# EAGLE design USBIRtoy.v1-pub (EAGLE 5.07)
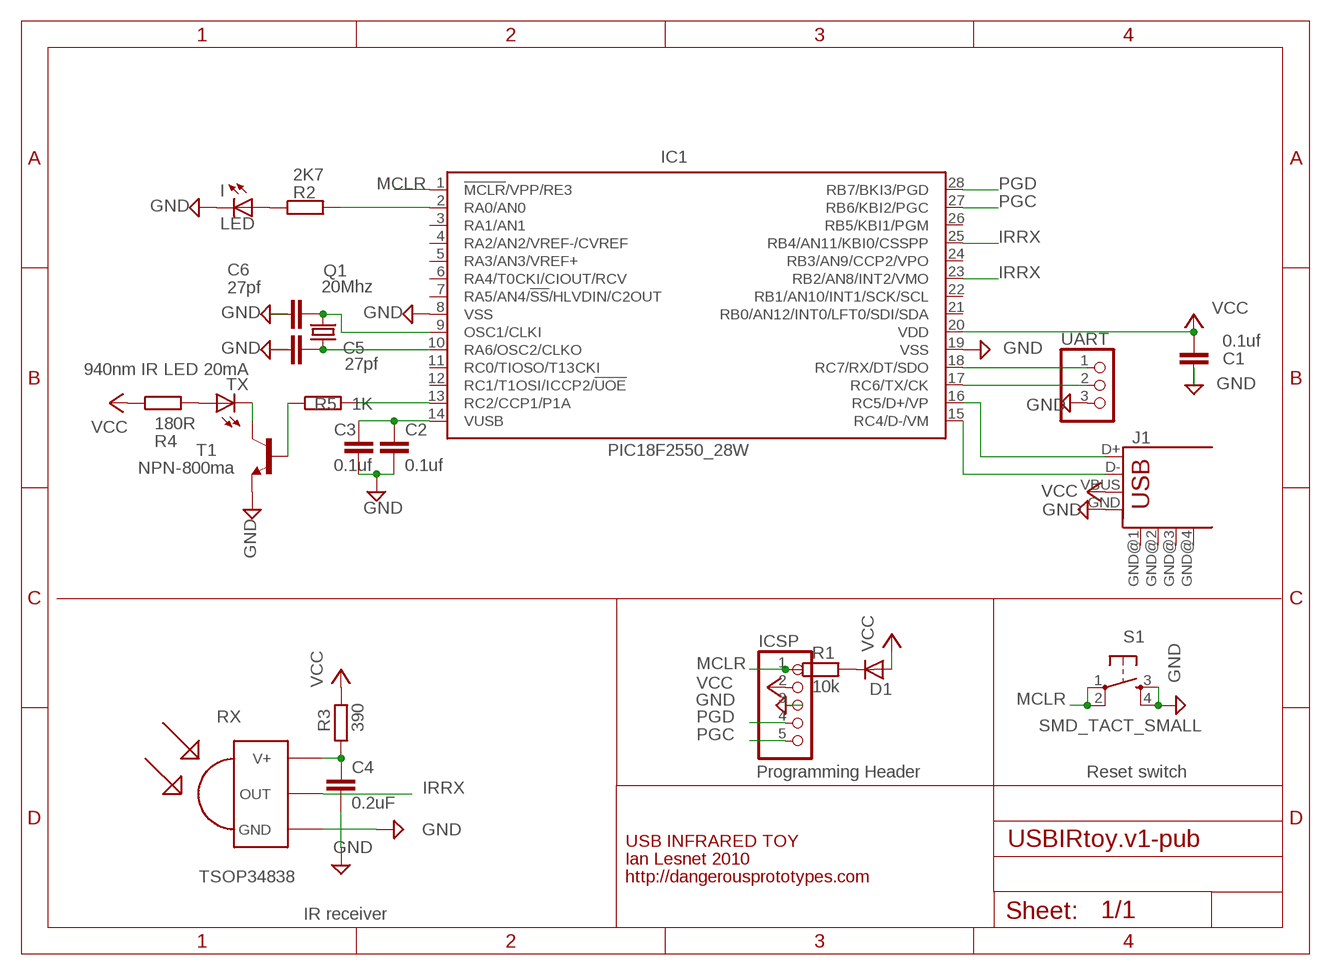
[diagram p0: schematic, sheet 1]

## Parts
C1  0.1uf  C-EUC0805  [C0805]
C2  0.1uf  C-EUC0805  [C0805]
C3  0.1uf  C-EUC0805  [C0805]
C4  0.2uF  C-EUC0805  [C0805]
C5  27pf  C-EUC0805  [C0805]
C6  27pf  C-EUC0805  [C0805]
D1  DIODE_SOD-323  [SOD2514X100N]
I  LED  LEDCHIP-LED0805  [CHIP-LED0805]
IC1  PIC18F2550_28W  [SO28W]
ICSP  PINHD-1X5  [1X05]
J1  USB-SHIELD  [USB-M-S1]
Q1  20Mhz  CRYSTALHC49UP  [HC49UP]
R1  10k  R-EU_R0805  [R0805]
R2  2K7  R-EU_M0805  [M0805]
R3  390  R-EU_M0805  [M0805]
R4  180R  R-EU_M0805  [M0805]
R5  1K  R-EU_M0805  [M0805]
S1  SMD_TACT_SMALL  [TACT_SWITCH_SMALL]
T1  NPN-800ma  BCX70SMD  [SOT23]
TSOP34838  TSOP34838  TSOP4838  [TSOP18XX]
TX  940nm IR LED 20mA  LED5MM  [LED5MM]
UART  PINHD-1X3  [1X03]

## Nets
GND: C1.2 C2.2 C3.2 C4.2 C5.2 C6.2 I.C IC1.8(VSS) IC1.19(VSS) ICSP.3 J1.GND S1.3 S1.4 T1.2(E) TSOP34838.GND UART.3
IRRX: IC1.23(RB2/AN8/INT2/VMO) IC1.25(RB4/AN11/KBI0/CSSPP) TSOP34838.OUT
MCLR: IC1.1(!MCLR!/VPP/RE3) ICSP.1 R1.1 S1.1 S1.2
N$1: C6.1 IC1.9(OSC1/CLKI) Q1.2
N$2: C5.1 IC1.10(RA6/OSC2/CLKO) Q1.1
N$3: C2.1 C3.1 IC1.14(VUSB)
N$4: IC1.17(RC6/TX/CK) UART.2
N$5: IC1.18(RC7/RX/DT/SDO) UART.1
N$6: R4.2 TX.A
N$7: I.A R2.1
N$8: C4.1 R3.1 TSOP34838.VCC(V+)
N$9: IC1.2(RA0/AN0) R2.2
N$11: IC1.13(RC2/CCP1/P1A) R5.2
N$12: R5.1 T1.1(B)
N$13: T1.3(C) TX.K(C)
N$17: D1.K R1.2
PGC: IC1.27(RB6/KBI2/PGC) ICSP.5
PGD: IC1.28(RB7/BKI3/PGD) ICSP.4
RC4: IC1.15(RC4/D-/VM) J1.D-
RC5: IC1.16(RC5/D+/VP) J1.D+
VCC: C1.1 D1.A IC1.20(VDD) ICSP.2 J1.VBUS R3.2 R4.1
Unconnected: IC1.3(RA1/AN1) IC1.4(RA2/AN2/VREF-/CVREF) IC1.5(RA3/AN3/VREF+) IC1.6(RA4/T0CKI/CIOUT/RCV) IC1.7(RA5/AN4/!SS!/HLVDIN/C2OUT) IC1.11(RC0/TIOSO/T13CKI) IC1.12(RC1/T1OSI/ICCP2/!UOE) IC1.21(RB0/AN12/INT0/LFT0/SDI/SDA) IC1.22(RB1/AN10/INT1/SCK/SCL) IC1.24(RB3/AN9/CCP2/VPO) IC1.26(RB5/KBI1/PGM) J1.GND@1(GND) J1.GND@2(GND) J1.GND@3(GND) J1.GND@4(GND)

## Notes on the sheet
- J1
- RX
- Programming Header | Reset switch
- USB INFRARED TOY
- Ian Lesnet 2010
- TSOP34838 | http://dangerousprototypes.com
- IR receiver

## Library data of the parts
C1-C6 = rcl:C-EU: CAPACITOR, European symbol
D1 = ipc-7351-diode:DIODE_
I TX = led:LED: LED OSRAM: - CHIPLED LG R971, LG N971, LY N971, LG Q971, LY Q971, LO R971, LY R971 LH N974, LH R974 LS Q976, LO Q976, LY Q976 LO Q996 - Hyper CHIPLED LW Q18S LB Q993, LB Q99A, LB R99A - SideLED LS A670, LO A670, LY A670, LG A670, LP A670 LB A673, LV A673, LT A673, LW A673 LH A674 LY A675 LS A676, LA A676, LO A676, LY A676, LW A676 LS A679, LY A679, LG A679 - Hyper Micro SIDELED® LS Y876, LA Y876, LO Y876, LY Y876 LT Y87S - SmartLED LW L88C, LW L88S LB L89C, LB L89S, LG L890 LS L89K, LO L89K, LY L89K LS L896, LA L896, LO L896, LY L896 - TOPLED LS T670, LO T670, LY T670, LG T670, LP T670 LSG T670, LSP T670, LSY T670, LOP T670, LYG T670 LG T671, LOG T671, LSG T671 LB T673, LV T673, LT T673, LW T673 LH T674 LS T676, LA T676, LO T676, LY T676, LB T676, LH T676, LSB T676, LW T676 LB T67C, LV T67C, LT T67C, LS T67K, LO T67K, LY T67K, LW E67C LS E67B, LA E67B, LO E67B, LY E67B, LB E67C, LV E67C, LT E67C LW T67C LS T679, LY T679, LG T679 LS T770, LO T770, LY T770, LG T770, LP T770 LB T773, LV T773, LT T773, LW T773 LH T774 LS E675, LA E675, LY E675, LS T675 LS T776, LA T776, LO T776, LY T776, LB T776 LHGB T686 LT T68C, LB T68C - Hyper Mini TOPLED® LB M676 - Mini TOPLED Santana® LG M470 LS M47K, LO M47K, LY M47K Source: http://www.osram.convergy.de LUXEON: - LUMILED® LXK2-PW12-R00, LXK2-PW12-S00, LXK2-PW14-U00, LXK2-PW14-V00 LXK2-PM12-R00, LXK2-PM12-S00, LXK2-PM14-U00 LXK2-PE12-Q00, LXK2-PE12-R00, LXK2-PE12-S00, LXK2-PE14-T00, LXK2-PE14-U00 LXK2-PB12-K00, LXK2-PB12-L00, LXK2-PB12-M00, LXK2-PB14-N00, LXK2-PB14-P00, LXK2-PB14-Q00 LXK2-PR12-L00, LXK2-PR12-M00, LXK2-PR14-Q00, LXK2-PR14-R00 LXK2-PD12-Q00, LXK2-PD12-R00, LXK2-PD12-S00 LXK2-PH12-R00, LXK2-PH12-S00 LXK2-PL12-P00, LXK2-PL12-Q00, LXK2-PL12-R00 Source: www.luxeon.com KINGBRIGHT: KA-3528ASYC Source: www.kingbright.com
IC1 = microchip:PIC18F2*_28: USB Microcontrollers with nanoWatt Technology High-Performance, Enhanced Flash, 28/40/44-Pin, Source: http://ww1.microchip.com/downloads/en/devicedoc/39632c.pdf
ICSP = pinhead-2:PINHD-1X5: PIN HEADER
J1 = con-usb-2:USB-SHIELD
Q1 = crystal:CRYSTAL: CRYSTAL
R1-R5 = rcl:R-EU_: RESISTOR, European symbol
S1 = DP-logo:SMD_TACT_SMALL
T1 = transistor:BCX70SMD: NPN TRANSISTOR
TSOP34838 = tsop:TSOP4838: IR Receiver and Demodulator
UART = pinhead-2:PINHD-1X3: PIN HEADER

## Board
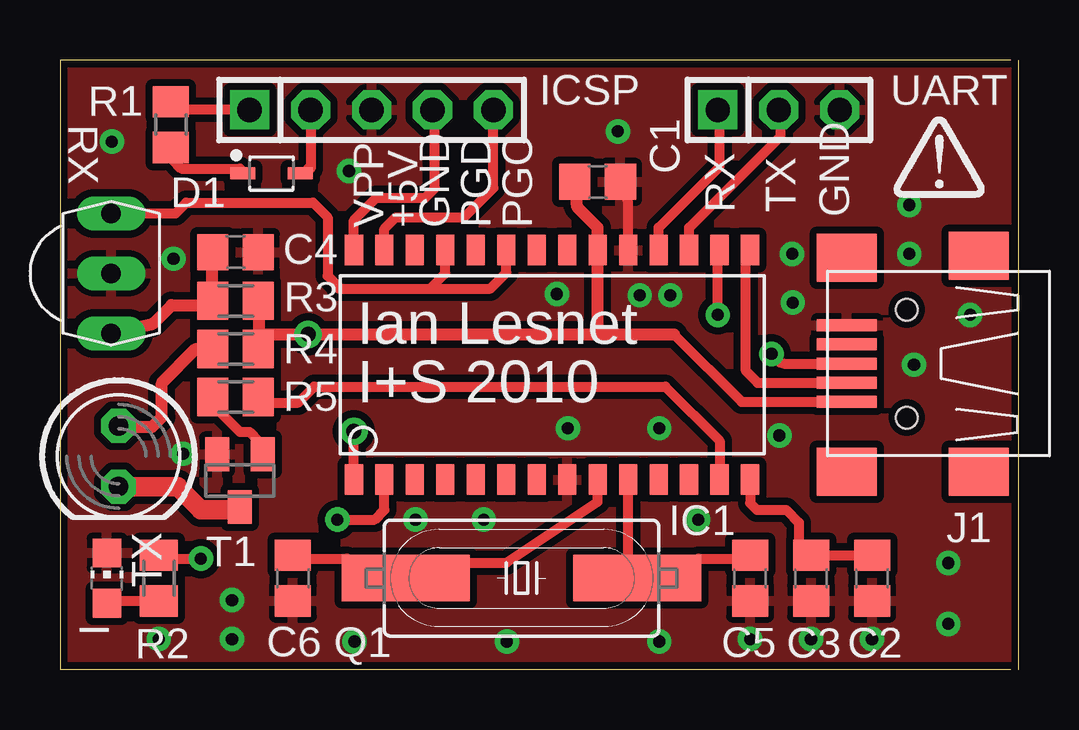
[diagram p1: board, top side]
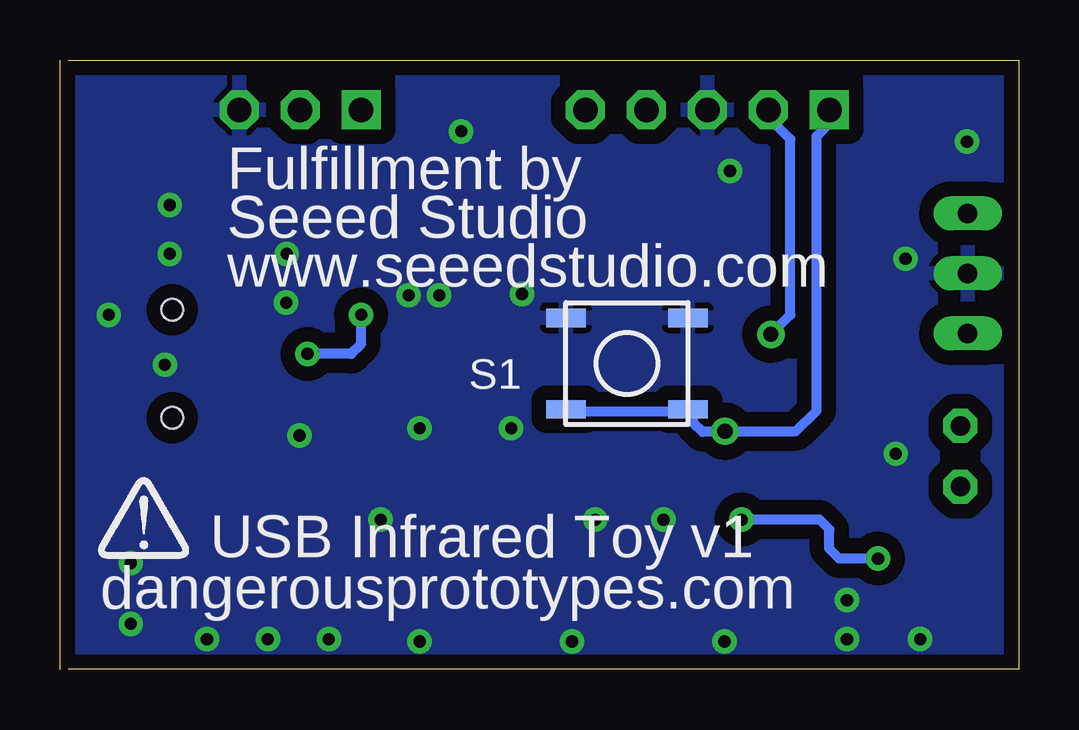
[diagram p2: board, bottom side, seen from below]

Size 39.94 x 25.4 mm. Coordinates in mm from the lower left corner, seen from the top.
Outline: 39.6,0 0,0 0,25.39 39.6,25.39
Outline: 39.94,0 39.94,25.4
Copper layers (1*16): Top 0.035mm / dielectric 1.5mm / Bottom 0.035mm
Design rules "SparkFun": minimum track width 8mil, minimum drill 20mil, track to track 8mil, track to pad 8mil, pad to pad 8mil, via to via 8mil, smd to smd 8mil, copper to edge 10mil, drill to drill 8mil, minimum pad ring 12mil, minimum via ring 10mil, stop-mask expansion 4mil, vias tented up to drill 25mil, thermal gap 10mil

### Footprints (pad centres in the part's own frame; a part is rotated, then mirrored left to right if it is on the bottom)
C0805 = smd 1.3 x 1.5: 1 -0.95,0; 2 0.95,0
SOD2514X100N = smd 1.05 x 0.5: A 1.2,0; K -1.2,0
CHIP-LED0805 = smd 1.2 x 1.2: A 0,-1.05; C 0,1.05
SO28W = smd 0.762 x 1.27: 1 -7.62,-4.78; 2 -6.35,-4.78; 3 -5.08,-4.78; 4 -3.81,-4.78; 5 -2.54,-4.78; 6 -1.27,-4.78; 7 0,-4.78; 8 1.27,-4.78; 9 2.54,-4.78; 10 3.81,-4.78; 11 5.08,-4.78; 12 6.35,-4.78; 13 7.62,-4.78; 14 8.89,-4.78; 15 8.89,4.78; 16 7.62,4.78; 17 6.35,4.78; 18 5.08,4.78; 19 3.81,4.78; 20 2.54,4.78; 21 1.27,4.78; 22 0,4.78; 23 -1.27,4.78; 24 -2.54,4.78; 25 -3.81,4.78; 26 -5.08,4.78; 27 -6.35,4.78; 28 -7.62,4.78
1X05 = drill 1.016 square: 1 -5.08,0 | drill 1.016 octagon: 2 -2.54,0; 3 0,0; 4 2.54,0; 5 5.08,0
USB-M-S1 = smd 2.5 x 0.5: D+ 2.75,0; D- 2.75,0.8; GND 2.75,-1.6; ID 2.75,-0.8; VBUS 2.75,1.6 | smd 2.5 x 2: GND@1 -2.75,-4.5; GND@2 -2.75,4.5; GND@3 2.75,-4.4; GND@4 2.75,4.5 | hole 0.9: 0.25,2.25; 0.25,-2.25
HC49UP = smd 5.334 x 1.93: 1 -4.826,0; 2 4.826,0
R0805 = smd 1.3 x 1.5: 1 -0.95,0; 2 0.95,0
M0805 = smd 1.3 x 1.6: 1 -0.95,0; 2 0.95,0
TACT_SWITCH_SMALL = smd 1.651 x 0.762: 1 -2.54,1.905; 2 2.54,1.905; 3 -2.54,-1.905; 4 2.54,-1.905
SOT23 = smd 1 x 1.4: 1 -0.95,-1.1; 2 0.95,-1.1; 3 0,1.1
TSOP18XX = drill 0.813 long: GND -0.001,-0.027; OUT -2.501,-0.027; VCC 2.499,-0.027
LED5MM = drill 0.813 octagon: A -1.27,0; K 1.27,0
1X03 = drill 1.016 square: 1 -2.54,0 | drill 1.016 octagon: 2 0,0; 3 2.54,0

### Placement (x,y rotation side)
C1  22.39,20.32 0 top
C2  33.82,3.81 270 top
C3  31.28,3.81 270 top
C4  7.3,17.4 0 top
C5  28.74,3.81 270 top
C6  9.69,3.81 270 top
D1  8.8,20.68 0 top
I  1.94,3.81 0 top
IC1  19.85,12.7 0 top
ICSP  12.97,23.32 0 top
J1  35.52,12.75 180 top
Q1  19.22,3.81 180 top
R1  4.61,22.71 270 top
R2  4.1,3.81 90 top
R3  7.3,15.37 0 top
R4  7.3,13.36 180 top
R5  7.3,11.35 0 top
S1  16.32,12.75 180 bottom
T1  7.48,7.87 180 top
TSOP34838  2.15,16.51 270 top
TX  2.43,8.89 270 top
U$1  [DP-LOGO]  34.71,19.66 0 top
U$2  [DP-LOGO]  38.37,4.62 0 bottom
UART  29.93,23.32 0 top

### Tracks (layer width: path | path; a pad name or v marks a point on that pad's centre or on a via)
GND  (via drill 0.51)
  Top 0.406: IC1.19 23.66,19.47 C1.2
  other vias: 2.15,22 35.37,19.35 20.69,15.65 37,1.9 28.74,1.27 31.28,1.27 33.82,1.27 7.15,1.27 4.1,1.27 23.23,22.43 29.96,9.75 30.52,15.29 24.14,15.6 25.41,15.6 37,4.44 35.37,17.32 14.8,6.25 17.64,6.25 26.58,6.25 21.15,10.06 24.96,10.06 12.26,1.17 18.61,1.17 24.96,1.17 37.91,14.78 35.57,12.7 5.12,8.99 7.15,2.9 30.49,17.32 4.71,17.12 12.03,20.78
  pour Bottom (isolate 0.61): -2.37,25.4 39.54,25.4 39.54,0 -2.37,0
  pour Top (isolate 0.305): -2.37,25.4 39.54,25.4 39.54,0 -2.37,0
IRRX
  Top 0.406: IC1.25 16.04,16.51 15.41,15.87 | IC1.23 18.58,16.54 17.92,15.87 15.41,15.87 | 15.41,15.87 11.6,15.87 11.6,15.95 11.14,16.41 11.14,18.85 10.53,19.46 5.25,19.46 4.8,19.01 TSOP34838.OUT
MCLR  (via drill 0.64 pad 0.51)
  Top 0.406: IC1.1 v12.23,9.93 | R1.1 4.9,23.32 ICSP.1
  Bottom 0.406: ICSP.1 7.89,22.86 7.79,22.86 8.42,22.22 8.42,10.79 9.28,9.93 v12.23,9.93 12.26,9.91 13.17,9.91 13.55,10.29 13.55,10.74 | 13.55,10.74 18.76,10.74 S1.2 | S1.1 13.65,10.85 13.55,10.74
N$1
  Top 0.406: IC1.9 22.39,6.98 18.58,4.44 15.66,4.44 Q1.2 12.76,3.81 11.95,4.62 9.73,4.62 C6.1
N$2
  Top 0.406: IC1.10 23.66,4.19 Q1.1 25.77,3.81 26.58,4.62 28.7,4.62 C5.1
N$3
  Top 0.406: C2.1 C3.1 31.27,4.66 30.77,5.16 30.77,6.12 30.24,6.65 29.02,6.65 28.74,6.93 IC1.14
N$4
  Top 0.406: IC1.17 26.2,18.41 30.01,22.22 30.01,22.86 30.01,23.32 | 30.01,23.32 30.01,23.5 | 30.01,23.32 UART.2
N$5
  Top 0.406: IC1.18 24.93,18.41 27.47,20.96 27.47,22.86 27.47,23.32 | 27.47,23.32 27.47,23.5 | 27.47,23.32 UART.1
N$6
  Top 0.406: TX.A 2.45,10.16 2.5,10.11
  Top 0.508: R4.2 5.65,13.36 4.23,11.94 4.23,10.52 3.82,10.11 2.5,10.11 2.48,10.11 TX.A
N$7
  Top 0.406: R2.1 1.84,2.86 I.A
N$8
  Top 0.508: C4.1 6.33,16.66 R3.1 6.07,15.19 4.64,15.19 3.86,14.42 TSOP34838.VCC
N$9  (via drill 0.51)
  Top 0.406: IC1.2 13.5,6.65 13.09,6.25 v11.54,6.25 | v5.86,4.62 4.24,4.62 R2.2
  Bottom 0.406: v11.54,6.25 8.29,6.25 7.89,5.84 7.89,5.03 7.48,4.62 v5.86,4.62
N$11
  Top 0.406: IC1.13 27.47,9.52 25.21,11.79 10.58,11.79 9.92,11.12 8.33,11.12 R5.2
N$12
  Top 0.406: 8.41,8.97 T1.1 8.29,9.11 8.29,9.5 7.89,9.91 7.48,9.91 6.26,11.12 6.35,11.44 R5.1
N$13
  Top 0.813: TX.K 4.89,7.62 5.86,6.65 7.36,6.65 T1.3
N$17
  Top 0.406: R1.2 4.64,21.83 4.64,21.29 5.04,20.88 7.48,20.88 7.68,20.68 D1.K
PGC
  Top 0.406: IC1.27 13.5,18.36 13.98,18.85 16.83,18.85 18.05,20.07 ICSP.5
PGD
  Top 0.406: IC1.28 12.23,18.72 13.17,19.66 15.2,19.66 15.61,20.07 15.61,23.32 ICSP.4
RC4
  Top 0.406: IC1.15 28.74,17.14 28.56,17.32 28.56,12.45 29.06,11.95 J1.D- 32.82,11.95
RC5  (via drill 0.51)
  Top 0.406: v27.39,14.78 27.39,17.4 IC1.16 | v29.63,13.16 29.99,12.8 30.14,12.75 J1.D+ 32.82,12.75
  Bottom 0.406: v27.39,14.78 27.39,13.56 27.8,13.16 v29.63,13.16
VCC  (via drill 0.64)
  Top 0.406: ICSP.2 10.43,20.88 10.33,20.88 10.12,20.68 D1.A | 32.9,11.12 33.49,11.12 33.46,11.15 J1.VBUS 28.38,11.15 25.57,13.97
  Top 0.508: 22.39,13.97 v10.33,13.97 8.29,13.97 | C1.1 21.54,19.26 22.39,18.41 IC1.20 22.39,13.97 | 22.39,13.97 25.57,13.97 | 8.29,13.97 8.29,14.87 R3.2 | 8.29,13.97 8.29,12.97 R4.1
  Bottom 0.406: v10.33,13.97 9.51,14.78 9.51,22.1 10.33,22.91 10.43,22.91 ICSP.2

### Text on the board
tNames: RX | RX | TX | VPP | +5V | GND | PGD | PGC | GND | Ian Lesnet | I+S 2010
bNames: Fulfillment by | Seeed Studio | www.seeedstudio.com | USB Infrared Toy v1 | dangerousprototypes.com
Reference: Serial Port | Programming Header | MCLR | +5V | GND | DATA | CLOCK | RX | TX | +5V | GND | USB INFRARED TOY | CC-BY-SA-NC | USB | Ian Lesnet 2010 | http://dangerousprototypes.com | LED